# Altium schematic sheet USB_HUB_4 Port.SchDoc
size A3
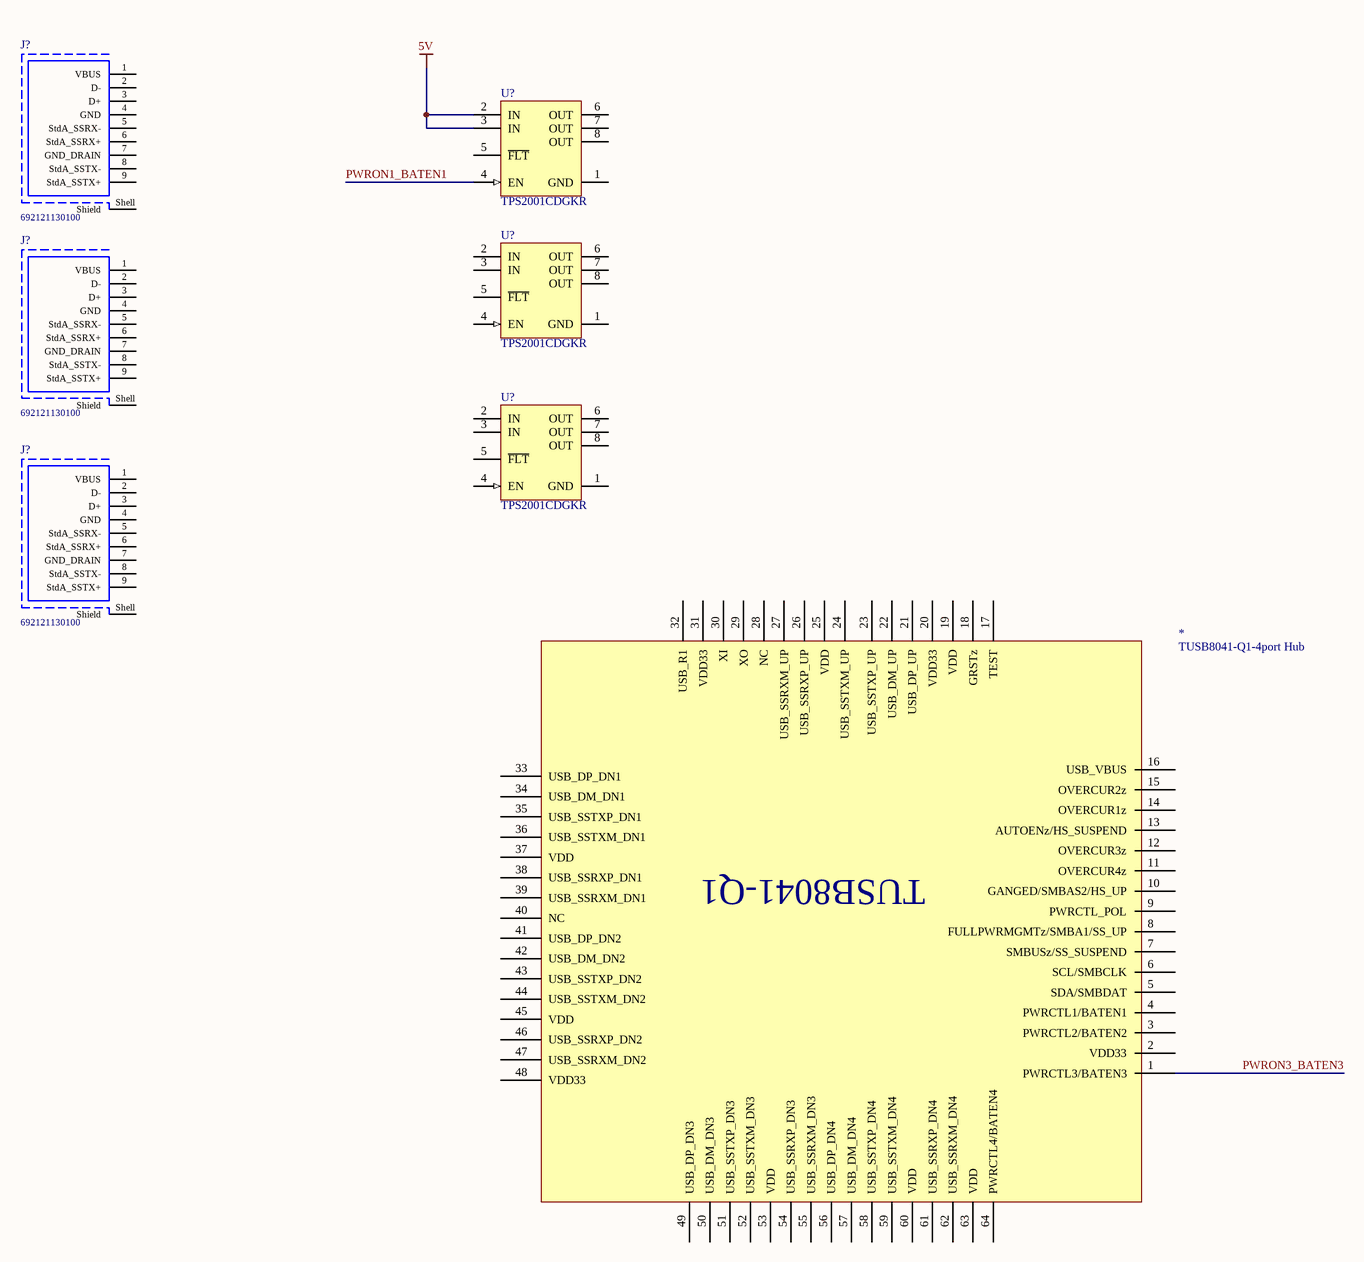
[diagram p0: USB_HUB_4 Port.SchDoc]

## Parts
(Parts that share a designator on the sheet are numbered #1, #2 ... from top to bottom, then left to right.)
*  TUSB8041-Q1-4port Hub  [TSQFP50P1200X1200X120-64N]
J?#1  692121130100  [692121130100]
J?#2  692121130100  [692121130100]
J?#3  692121130100  [692121130100]
U?#1  TPS2001CDGKR  [DGK0008A_L]
U?#2  TPS2001CDGKR  [DGK0008A_L]
U?#3  TPS2001CDGKR  [DGK0008A_L]

## Nets
5V: U?#1.2(IN) U?#1.3(IN)
PWRON1_BATEN1: U?#1.4(EN)
PWRON3_BATEN3: *.1(PWRCTL3/BATEN3)

Not connected (* = marked no-connect by the designer): * 2(VDD33) 3(PWRCTL2/BATEN2) 4(PWRCTL1/BATEN1) 5(SDA/SMBDAT) 6(SCL/SMBCLK) 7(SMBUSz/SS_SUSPEND) 8(FULLPWRMGMTz/SMBA1/SS_UP) 9(PWRCTL_POL) 10(GANGED/SMBAS2/HS_UP) 11(OVERCUR4z) 12(OVERCUR3z) 13(AUTOENz/HS_SUSPEND) 14(OVERCUR1z) 15(OVERCUR2z) 16(USB_VBUS) 17(TEST) 18(GRSTz) 19(VDD) 20(VDD33) 21(USB_DP_UP) 22(USB_DM_UP) 23(USB_SSTXP_UP) 24(USB_SSTXM_UP) 25(VDD) 26(USB_SSRXP_UP) 27(USB_SSRXM_UP) 28(NC) 29(XO) 30(XI) 31(VDD33) 32(USB_R1) 33(USB_DP_DN1) 34(USB_DM_DN1) 35(USB_SSTXP_DN1) 36(USB_SSTXM_DN1) 37(VDD) 38(USB_SSRXP_DN1) 39(USB_SSRXM_DN1) 40(NC) 41(USB_DP_DN2) 42(USB_DM_DN2) 43(USB_SSTXP_DN2) 44(USB_SSTXM_DN2) 45(VDD) 46(USB_SSRXP_DN2) 47(USB_SSRXM_DN2) 48(VDD33) 49(USB_DP_DN3) 50(USB_DM_DN3) 51(USB_SSTXP_DN3) 52(USB_SSTXM_DN3) 53(VDD) 54(USB_SSRXP_DN3) 55(USB_SSRXM_DN3) 56(USB_DP_DN4) 57(USB_DM_DN4) 58(USB_SSTXP_DN4) 59(USB_SSTXM_DN4) 60(VDD) 61(USB_SSRXP_DN4) 62(USB_SSRXM_DN4) 63(VDD) 64(PWRCTL4/BATEN4); J?#1 1(VBUS) 2(D-) 3(D+) 4(GND) 5(StdA_SSRX-) 6(StdA_SSRX+) 7(GND_DRAIN) 8(StdA_SSTX-) 9(StdA_SSTX+) Shell(Shield); J?#2 1(VBUS) 2(D-) 3(D+) 4(GND) 5(StdA_SSRX-) 6(StdA_SSRX+) 7(GND_DRAIN) 8(StdA_SSTX-) 9(StdA_SSTX+) Shell(Shield); J?#3 1(VBUS) 2(D-) 3(D+) 4(GND) 5(StdA_SSRX-) 6(StdA_SSRX+) 7(GND_DRAIN) 8(StdA_SSTX-) 9(StdA_SSTX+) Shell(Shield); U?#1 1(GND) 5(~{FLT}) 6(OUT) 7(OUT) 8(OUT); U?#2 1(GND) 2(IN) 3(IN) 4(EN) 5(~{FLT}) 6(OUT) 7(OUT) 8(OUT); U?#3 1(GND) 2(IN) 3(IN) 4(EN) 5(~{FLT}) 6(OUT) 7(OUT) 8(OUT)

## Notes on the sheet
- Title
- Size:
- Date:
- A3
- Number:
- Time:
- Revision:
- Sheet
- of
- File:
- (in symbol TUSB8041-Q1-4port Hub) TUSB8041-Q1

## Library data of the parts
J?#1-J?#3 = CMP-1502-03218-1: USB 3.0 Type A Receptacle WR-COM, Reverse Horizontal, SMT / THT, with Clips, with 0.14 mm Offset; Manufacturer: Wurth Elektronik; Contact Resistance: 50mOhm; Rated Current: 0.25A; Working Voltage: 30VAC; Operating Temperature: -20to85degC; Packaging: TapeandReel; Datasheet URL: https://katalog.we-online.de/em/datasheet/692121130100.pdf; Orientation: ReverseHorizontal; Gender: Receptacle; Package Reference: 692121130100; Connector Type: USB3.0TypeA; Publisher: WurthElektronik; Manufacturer URL: http://www.we-online.de; Part Number: 692121130100; Mounting Technology: SMT/THT
U?#1-U?#3 = CMP-0337-00297-2: Single Channel, Current-Limited USB Power Distribution Switch, 2.9 A Current Limit, -40 to 85 degC, 8-pin VSSOP (DGK), Green (RoHS & no Sb/Br); Manufacturer: Texas Instruments; Current Limit(A): 2.9; rDS(on) per FET(Typ)(mOhms): 70; Discharge Function: TRUE; Rating: Catalog; Number of Switches: 1; Continuous Current(Max)(A): 2; Vin(Max)(V): 5.5; Vin(Min)(V): 4.5; Enable: Active High; Mounting Technology: Surface Mount; Eco-Plan: Green (RoHS & no Sb/Br); PartNumber: TPS2001CDGKR; ComponentLink1URL: http://www.ti.com/general/docs/lit/getliterature.tsp?genericPartNumber=TPS2001C&fileType=pdf; PackageDescription: 8-Pin Thin Small Outline Package 3 x 3 mm Body ,0.65 mm Pitch; ComponentLink1Description: Datasheet; UL Listed: TRUE; PackageVersion: revE, May-2006; DatasheetVersion: SLVSAU6E; PackageReference: DGK0008A; Code_JEDEC: MO-187-AA